# EAGLE design TinyShorty (EAGLE 5.06)
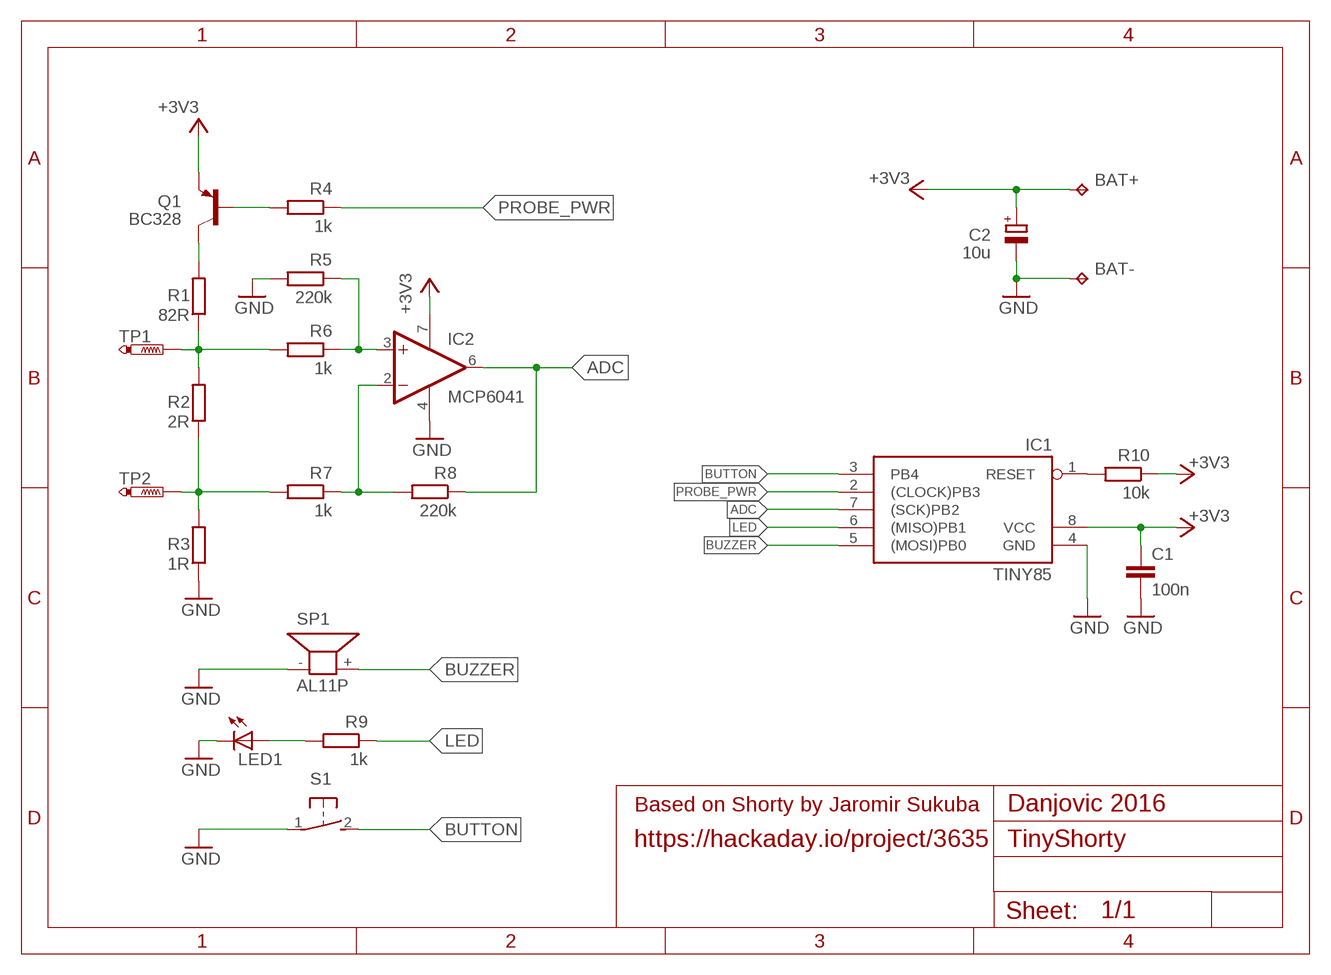
[diagram p0: schematic, sheet 1]

## Parts
BAT+  TPPAD1-13Y  [P1-13Y]
BAT-  TPPAD1-13Y  [P1-13Y]
C1  100n  C-EU050-024X044  [C050-024X044]
C2  10u  CPOL-EUE2-4  [E2-4]
IC1  TINY85  TINY22P  [DIL08]
IC2  MCP6041  MCP601P  [DIL08]
LED1  LED3MM  [LED3MM]
Q1  BC328  [TO92-EBC]
R1  82R  R-EU_0204/7  [0204/7]
R2  2R  R-EU_0204/7  [0204/7]
R3  1R  R-EU_0204/7  [0204/7]
R4  1k  R-EU_0204/7  [0204/7]
R5  220k  R-EU_0204/7  [0204/7]
R6  1k  R-EU_0204/7  [0204/7]
R7  1k  R-EU_0204/7  [0204/7]
R8  220k  R-EU_0204/7  [0204/7]
R9  1k  R-EU_0204/7  [0204/7]
R10  10k  R-EU_0204/7  [0204/7]
S1  31-XX  [B3F-31XX]
SP1  AL11P  [AL11P]
TP1  PTR1PAD1-13Y  [P1-13Y]
TP2  PTR1PAD1-13Y  [P1-13Y]

## Nets
+3V3: BAT+.1(TP) C1.1 C2.+ IC1.8(VCC) IC2.7(V+) Q1.E R10.1
ADC: IC1.7((SCK)PB2) IC2.6(OUT) R8.1
BUTTON: IC1.3(PB4) S1.2(S)
BUZZER: IC1.5((MOSI)PB0) SP1.+
GND: BAT-.1(TP) C1.2 C2.- IC1.4(GND) IC2.4(V-) LED1.K(C) R3.1 R5.2 S1.1(P) SP1.-
LED: IC1.6((MISO)PB1) R9.1
N$1: Q1.C R1.2
N$2: Q1.B R4.2
N$3: LED1.A R9.2
N$5: IC2.3(+IN) R5.1 R6.1
N$6: IC2.2(-IN) R7.1 R8.2
N$11: IC1.1(RESET) R10.2
PROBE_PWR: IC1.2((CLOCK)PB3) R4.1
TESTPAD1: R1.1 R2.2 R6.2 TP1.1(TP)
TESTPAD2: R2.1 R3.2 R7.2 TP2.1(TP)

## Notes on the sheet
- Based on Shorty by Jaromir Sukuba | Danjovic 2016
- https://hackaday.io/project/3635

## Library data of the parts
BAT+ BAT- = testpad:TP: Test pad
C1 = rcl:C-EU: CAPACITOR, European symbol
C2 = rcl:CPOL-EU: POLARIZED CAPACITOR, European symbol
IC1 = atmel:TINY22: MICROCONTROLLER 1K ROM 128 bytes RAM 128 bytes EEPROM
IC2 = linear:MCP601: Single Op Amp 2.7V to 6.0V Single Supply CMOS Source: http://ww1.microchip.com/downloads/en/DeviceDoc/21314g.pdf
LED1 = led:LED: LED OSRAM: - CHIPLED LG R971, LG N971, LY N971, LG Q971, LY Q971, LO R971, LY R971 LH N974, LH R974 LS Q976, LO Q976, LY Q976 LO Q996 - Hyper CHIPLED LW Q18S LB Q993, LB Q99A, LB R99A - SideLED LS A670, LO A670, LY A670, LG A670, LP A670 LB A673, LV A673, LT A673, LW A673 LH A674 LY A675 LS A676, LA A676, LO A676, LY A676, LW A676 LS A679, LY A679, LG A679 - Hyper Micro SIDELED® LS Y876, LA Y876, LO Y876, LY Y876 LT Y87S - SmartLED LW L88C, LW L88S LB L89C, LB L89S, LG L890 LS L89K, LO L89K, LY L89K LS L896, LA L896, LO L896, LY L896 - TOPLED LS T670, LO T670, LY T670, LG T670, LP T670 LSG T670, LSP T670, LSY T670, LOP T670, LYG T670 LG T671, LOG T671, LSG T671 LB T673, LV T673, LT T673, LW T673 LH T674 LS T676, LA T676, LO T676, LY T676, LB T676, LH T676, LSB T676, LW T676 LB T67C, LV T67C, LT T67C, LS T67K, LO T67K, LY T67K, LW E67C LS E67B, LA E67B, LO E67B, LY E67B, LB E67C, LV E67C, LT E67C LW T67C LS T679, LY T679, LG T679 LS T770, LO T770, LY T770, LG T770, LP T770 LB T773, LV T773, LT T773, LW T773 LH T774 LS E675, LA E675, LY E675, LS T675 LS T776, LA T776, LO T776, LY T776, LB T776 LHGB T686 LT T68C, LB T68C - Hyper Mini TOPLED® LB M676 - Mini TOPLED Santana® LG M470 LS M47K, LO M47K, LY M47K Source: http://www.osram.convergy.de LUXEON: - LUMILED® LXK2-PW12-R00, LXK2-PW12-S00, LXK2-PW14-U00, LXK2-PW14-V00 LXK2-PM12-R00, LXK2-PM12-S00, LXK2-PM14-U00 LXK2-PE12-Q00, LXK2-PE12-R00, LXK2-PE12-S00, LXK2-PE14-T00, LXK2-PE14-U00 LXK2-PB12-K00, LXK2-PB12-L00, LXK2-PB12-M00, LXK2-PB14-N00, LXK2-PB14-P00, LXK2-PB14-Q00 LXK2-PR12-L00, LXK2-PR12-M00, LXK2-PR14-Q00, LXK2-PR14-R00 LXK2-PD12-Q00, LXK2-PD12-R00, LXK2-PD12-S00 LXK2-PH12-R00, LXK2-PH12-S00 LXK2-PL12-P00, LXK2-PL12-Q00, LXK2-PL12-R00 Source: www.luxeon.com KINGBRIGHT: KA-3528ASYC Source: www.kingbright.com
Q1 = transistor-pnp:BC328*: PNP Transistror
R1-R10 = rcl:R-EU_: RESISTOR, European symbol
S1 = switch-omron:31-XX: OMRON SWITCH
SP1 = buzzer:AL11P: SPEAKER Source: Buerklin
TP1 TP2 = testpad:PTR1: TEST PIN

## Board
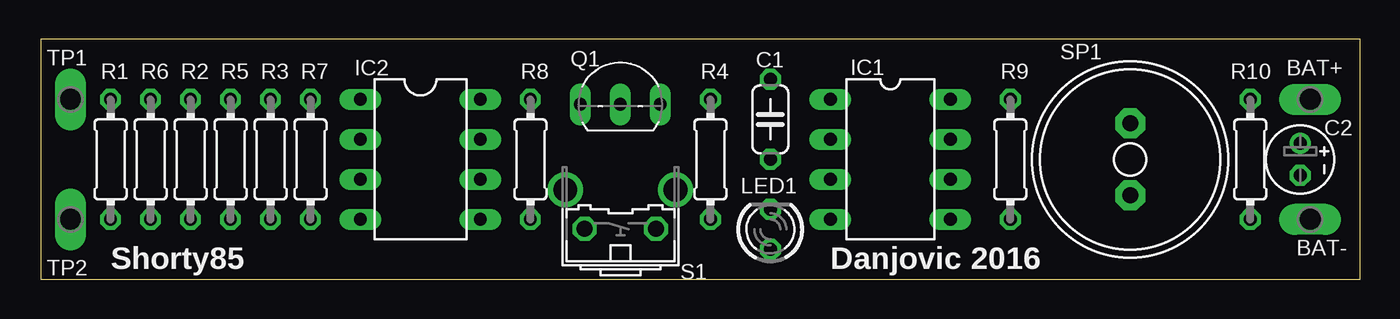
[diagram p1: board, top side]
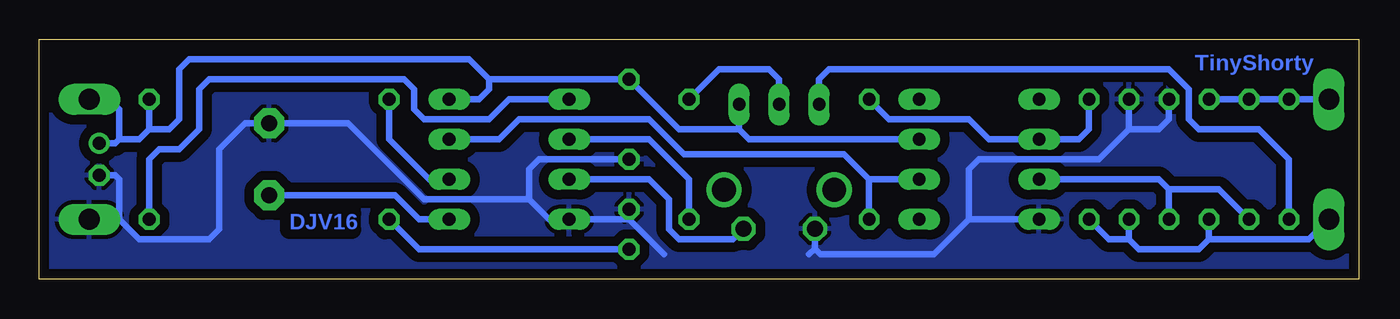
[diagram p2: board, bottom side, seen from below]

Size 83.82 x 15.24 mm. Coordinates in mm from the lower left corner, seen from the top.
Outline: 0,0 83.82,0 83.82,15.24 0,15.24 0,0
Copper layers (1*16): Top 0.035mm / dielectric 1.5mm / Bottom 0.035mm
Design rules "default *": minimum track width 10mil, minimum drill 24mil, track to track 8mil, track to pad 8mil, pad to pad 8mil, via to via 8mil, smd to smd 8mil, copper to edge 25mil, drill to drill 8mil, minimum pad ring 10mil, minimum via ring 8mil, stop-mask expansion 4mil, vias tented up to drill 0mil, thermal gap 10mil

### Footprints (pad centres in the part's own frame; a part is rotated, then mirrored left to right if it is on the bottom)
P1-13Y = drill 1.321 pad 1.905 long: 1 0,0
C050-024X044 = drill 0.813 octagon: 1 -2.54,0; 2 2.54,0
E2-4 = drill 0.813 pad 1.27 round: + -1.016,0 | drill 0.813 pad 1.27 octagon: - 1.016,0
DIL08 = drill 0.813 long: 1 -3.81,-3.81; 2 -1.27,-3.81; 3 1.27,-3.81; 4 3.81,-3.81; 5 3.81,3.81; 6 1.27,3.81; 7 -1.27,3.81; 8 -3.81,3.81
LED3MM = drill 0.813 octagon: A -1.27,0; K 1.27,0
TO92-EBC = drill 0.813 long: B 0,-1.27; C -2.54,-1.27; E 2.54,-1.27
0204/7 = drill 0.813 octagon: 1 -3.81,0; 2 3.81,0
B3F-31XX = drill 1.016 octagon: 1 -2.261,-1.245; 2 2.261,-1.245 | drill 1.499 pad 2.159 round: 3 -3.505,1.245; 4 3.505,1.245
AL11P = drill 1.016 pad 1.905 octagon: + 2.286,0; - -2.286,0

### Placement (x,y rotation side)
BAT+  80.64,11.43 270 top
BAT-  80.64,3.81 90 top
C1  46.35,10.16 270 top
C2  80.01,7.62 270 top
IC1  53.98,7.62 270 top
IC2  24.13,7.62 270 top
LED1  46.35,3.17 90 top
Q1  36.83,12.38 0 top
R1  4.45,7.62 270 top
R2  9.53,7.62 90 top
R3  14.61,7.62 270 top
R4  42.55,7.62 90 top
R5  12.06,7.62 90 top
R6  6.99,7.62 90 top
R7  17.14,7.62 270 top
R8  31.11,7.62 90 top
R9  61.59,7.62 270 top
R10  76.83,7.62 270 top
S1  36.83,4.45 0 top
SP1  69.22,7.62 270 top
TP1  1.91,11.43 0 top
TP2  1.91,3.81 0 top

### Tracks (layer width: path | path; a pad name or v marks a point on that pad's centre or on a via)
+3V3
  Bottom 0.406: IC2.7 38.73,8.89 39.37,9.53 | 39.37,9.53 43.18,9.53 C1.1 55.24,12.7 | 39.37,9.53 Q1.E | C2.+ 78.99,8.64 78.74,8.89 | 55.24,12.7 56.52,13.97 74.3,13.97 74.93,13.34 74.93,10.16 75.56,9.53 76.83,9.53 | IC1.8 55.88,11.43 55.24,12.06 55.24,12.7 | BAT+.1 79.38,11.43 78.74,10.79 78.74,8.89 | 78.74,8.89 77.47,8.89 76.83,9.53 | 76.83,9.53 R10.1
ADC
  Bottom 0.406: IC1.7 54.61,8.89 53.34,10.16 45.09,10.16 42.86,7.94 32.7,7.94 31.11,6.35 | 31.11,6.35 IC2.6 | R8.1 31.11,6.35
BUTTON
  Bottom 0.406: IC1.3 45.09,6.35 43.81,5.08 43.81,3.17 43.18,2.54 39.75,2.54 S1.2
BUZZER
  Bottom 0.406: IC1.5 59.69,3.81 61.21,5.33 SP1.+
GND
  Bottom 0.406: 14.61,9.53 16.51,7.62 24.13,7.62 24.77,6.99 24.77,3.81 | C1.2 52.07,7.62 52.7,6.99 52.7,5.08 | 34.57,1.94 S1.1 | 34.57,1.94 34.92,1.59 | 34.57,1.94 34.21,1.59 26.99,1.59 24.77,3.81 | 24.77,3.81 IC2.4 | 14.61,9.53 12.7,9.53 12.06,10.16 R5.2 | 14.61,9.53 R3.1 | 46.35,3.81 IC1.4 51.44,3.81 52.7,5.08 | 44.13,1.59 46.35,3.81 | 46.35,3.81 LED1.K | 52.7,5.08 59.37,5.08 64.2,9.91 SP1.- 70.74,9.91 72.39,8.26 72.39,3.17 73.03,2.54 77.47,2.54 78.74,3.81 | C2.- 78.99,6.6 78.74,6.35 78.74,3.81 | 78.74,3.81 BAT-.1
  pour Bottom (isolate 0.61): 0,0 83.82,0 83.82,15.24 0,15.24
LED
  Bottom 0.406: R9.1 61.59,8.89 59.05,6.35 IC1.6
N$1
  Bottom 0.406: R1.2 4.45,7.62 6.35,9.53 10.16,9.53 10.79,10.16 10.79,12.06 12.06,13.34 33.66,13.34 34.29,12.7 Q1.C
N$2
  Bottom 0.406: Q1.B 36.83,12.7 37.47,13.34 40.64,13.34 R4.2
N$3
  Bottom 0.406: LED1.A 59.69,1.91 R9.2
N$5
  Bottom 0.406: IC2.3 12.7,6.35 12.06,5.71 | 12.06,5.71 8.89,5.71 R6.1 | 12.06,5.71 R5.1
N$6
  Bottom 0.406: R7.1 17.14,9.53 17.78,8.89 IC2.2 23.5,8.89 24.77,10.16 29.84,10.16 R8.2
N$11
  Bottom 0.406: IC1.1 53.98,11.43 55.24,10.16 59.37,10.16 60.01,10.79 60.01,12.06 60.64,12.7 73.03,12.7 73.66,12.06 73.66,9.53 74.93,8.26 76.2,8.26 76.83,7.62 R10.2
PROBE_PWR
  Bottom 0.406: IC1.2 45.09,8.89 42.55,6.35 R4.1
TESTPAD1
  Bottom 0.406: TP1.1 R1.1 R6.2 R2.2
TESTPAD2
  Bottom 0.406: TP2.1 3.17,2.54 9.53,2.54 | 9.53,2.54 10.16,1.91 13.97,1.91 14.61,2.54 | 14.61,2.54 15.88,2.54 R7.2 | 14.61,2.54 R3.2 | 9.53,2.54 R2.1

### Text on the board
Bottom: TinyShorty | DJV16
tPlace: Shorty85 | Danjovic 2016